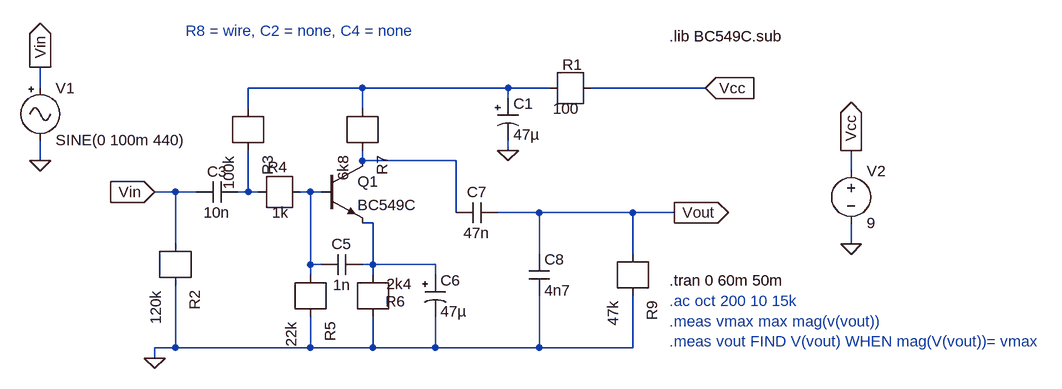
[diagram p0: schematic silicon.asc]
silicon.asc, the LTspice schematic file:
Version 4
SHEET 1 1484 680
WIRE -288 64 -288 32
WIRE 208 64 32 64
WIRE 432 64 208 64
WIRE 496 64 432 64
WIRE 736 64 560 64
WIRE 432 80 432 64
WIRE 32 96 32 64
WIRE 208 96 208 64
WIRE 432 160 432 144
WIRE -288 176 -288 144
WIRE 208 176 208 160
WIRE 352 176 208 176
WIRE 960 192 960 160
WIRE -80 224 -112 224
WIRE -48 224 -80 224
WIRE 32 224 32 160
WIRE 32 224 16 224
WIRE 48 224 32 224
WIRE 128 224 112 224
WIRE 144 224 128 224
WIRE 352 256 352 176
WIRE 480 256 416 256
WIRE 624 256 480 256
WIRE 688 256 624 256
WIRE 224 272 208 272
WIRE -80 304 -80 224
WIRE 960 304 960 272
WIRE 480 320 480 256
WIRE 624 320 624 256
WIRE 128 336 128 224
WIRE 144 336 128 336
WIRE 224 336 224 272
WIRE 224 336 208 336
WIRE 320 336 224 336
WIRE 128 352 128 336
WIRE 224 352 224 336
WIRE 320 352 320 336
WIRE -80 464 -80 368
WIRE -80 464 -112 464
WIRE 128 464 128 416
WIRE 128 464 -80 464
WIRE 224 464 224 416
WIRE 224 464 128 464
WIRE 320 464 320 416
WIRE 320 464 224 464
WIRE 480 464 480 384
WIRE 480 464 320 464
WIRE 624 464 624 384
WIRE 624 464 480 464
WIRE -112 480 -112 464
FLAG -112 224 Vin
IOPIN -112 224 In
FLAG -112 480 0
FLAG 432 160 0
FLAG 736 64 Vcc
IOPIN 736 64 In
FLAG 688 256 Vout
IOPIN 688 256 Out
FLAG -288 32 Vin
IOPIN -288 32 Out
FLAG -288 176 0
FLAG 960 304 0
FLAG 960 160 Vcc
IOPIN 960 160 Out
SYMBOL npn 144 176 R0
SYMATTR InstName Q1
SYMATTR Value BC549C
SYMBOL r 48 224 R0
WINDOW 0 45 -38 Right 2
WINDOW 3 46 32 Right 2
SYMATTR InstName R4
SYMATTR Value 1k
SYMBOL r 32 96 R90
SYMATTR InstName R3
SYMATTR Value 100k
SYMBOL r 128 352 R90
SYMATTR InstName R5
SYMATTR Value 22k
SYMBOL r 224 352 R90
WINDOW 0 41 -50 VRight 2
WINDOW 3 14 -60 VRight 2
SYMATTR InstName R6
SYMATTR Value 2k4
SYMBOL r 208 96 R90
SYMATTR InstName R7
SYMATTR Value 6k8
SYMBOL r 560 64 R180
WINDOW 0 44 36 Right 2
WINDOW 3 59 -32 Right 2
SYMATTR InstName R1
SYMATTR Value 100
SYMBOL cap 16 208 R90
WINDOW 0 0 32 VBottom 2
WINDOW 3 32 32 VTop 2
SYMATTR InstName C3
SYMATTR Value 10n
SYMBOL cap 416 240 R90
WINDOW 0 0 32 VBottom 2
WINDOW 3 32 32 VTop 2
SYMATTR InstName C7
SYMATTR Value 47n
SYMBOL cap 144 352 R270
WINDOW 0 32 32 VTop 2
WINDOW 3 0 32 VBottom 2
SYMATTR InstName C5
SYMATTR Value 1n
SYMBOL polcap 304 352 R0
SYMATTR InstName C6
SYMATTR Value 47µ
SYMBOL polcap 416 80 R0
SYMATTR InstName C1
SYMATTR Value 47µ
SYMBOL cap 464 320 R0
SYMATTR InstName C8
SYMATTR Value 4n7
SYMBOL r 624 320 R90
SYMATTR InstName R9
SYMATTR Value 47k
SYMBOL signal -288 48 R0
SYMATTR InstName V1
SYMATTR Value SINE(0 100m 440)
SYMATTR Value2 AC 100m
SYMBOL voltage 960 176 R0
SYMATTR InstName V2
SYMATTR Value 9
SYMBOL r -80 304 R90
SYMATTR InstName R2
SYMATTR Value 120k
TEXT 680 360 Left 2 !.tran 0 60m 50m
TEXT -64 -24 Left 2 ;R8 = wire, C2 = none, C4 = none
TEXT 680 -16 Left 2 !.lib BC549C.sub
TEXT 680 392 Left 2 ;.ac oct 200 10 15k\n.meas vmax max mag(v(vout))\n.meas vout FIND V(vout) WHEN mag(V(vout))= vmax

The netlist it stands for:
* silicon.asc
Q1 N002 N004 N005 0 BC549C
R4 N004 N003 1k
R3 N003 N001 100k
R5 0 N004 22k
R6 0 N005 2k4
R7 N002 N001 6k8
R1 N001 Vcc 100
C3 N003 Vin 10n
C7 Vout N002 47n
C5 N004 N005 1n
C6 N005 0 47µ
C1 N001 0 47µ
C8 Vout 0 4n7
R9 0 Vout 47k
V1 Vin 0 SINE(0 100m 440) AC 100m
V2 Vcc 0 9
R2 0 Vin 120k
.model NPN NPN
.model PNP PNP
.lib standard.bjt
.tran 0 60m 50m
* R8 = wire, C2 = none, C4 = none
.lib BC549C.sub
* .ac oct 200 10 15k
* .meas vmax max mag(v(vout))
* .meas vout FIND V(vout) WHEN mag(V(vout))= vmax
.backanno
.end